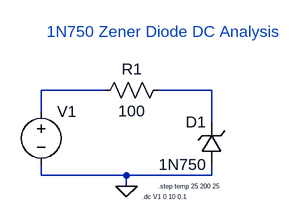
[diagram p0: schematic 1N750 Zener Diode DC Analysis.asc]
1N750 Zener Diode DC Analysis.asc, the LTspice schematic file:
Version 4
SHEET 1 1048 680
WIRE 48 80 -48 80
WIRE 208 80 128 80
WIRE -48 112 -48 80
WIRE 208 128 208 80
WIRE -48 208 -48 192
WIRE 80 208 -48 208
WIRE 208 208 208 192
WIRE 208 208 80 208
WIRE 80 224 80 208
FLAG 80 224 0
SYMBOL zener 224 192 R180
WINDOW 0 24 64 Left 2
WINDOW 3 24 0 Left 2
SYMATTR InstName D1
SYMATTR Value 1N750
SYMATTR Description Diode
SYMATTR Type diode
SYMBOL voltage -48 96 R0
WINDOW 123 0 0 Left 0
WINDOW 39 0 0 Left 0
SYMATTR InstName V1
SYMATTR Value ""
SYMBOL res 144 64 R90
WINDOW 0 0 56 VBottom 2
WINDOW 3 32 56 VTop 2
SYMATTR InstName R1
SYMATTR Value 100
TEXT 104 240 Left 0 !.dc V1 0 10 0.1
TEXT 128 224 Left 0 !.step temp 25 200 25
TEXT -40 -8 Left 2 ;1N750 Zener Diode DC Analysis

The netlist it stands for:
* 1N750 Zener Diode DC Analysis.asc
D1 0 N002 1N750
V1 N001 0
R1 N002 N001 100
.model D D
.lib standard.dio
.dc V1 0 10 0.1
.step temp 25 200 25
* 1N750 Zener Diode DC Analysis
.backanno
.end